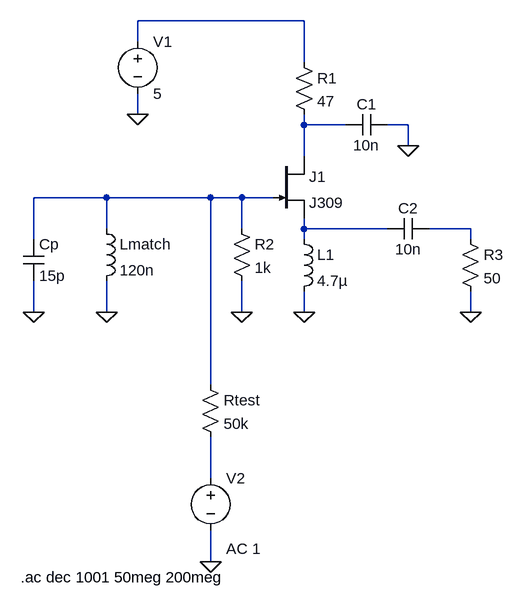
[diagram p0: schematic jfet_buffer.asc]
jfet_buffer.asc, the LTspice schematic file:
Version 4
SHEET 1 880 760
WIRE 112 -112 -144 -112
WIRE -144 -80 -144 -112
WIRE 112 -48 112 -112
WIRE -144 32 -144 0
WIRE 112 48 112 32
WIRE 176 48 112 48
WIRE 272 48 240 48
WIRE 272 80 272 48
WIRE 112 96 112 48
WIRE -192 160 -304 160
WIRE -32 160 -192 160
WIRE 16 160 -32 160
WIRE 64 160 16 160
WIRE -192 208 -192 160
WIRE 16 208 16 160
WIRE 112 208 112 192
WIRE 240 208 112 208
WIRE 368 208 304 208
WIRE -304 224 -304 160
WIRE 112 224 112 208
WIRE 368 224 368 208
WIRE -304 336 -304 288
WIRE -192 336 -192 288
WIRE 16 336 16 288
WIRE 112 336 112 304
WIRE 368 336 368 304
WIRE -32 448 -32 160
WIRE -32 592 -32 528
WIRE -32 720 -32 672
FLAG -144 32 0
FLAG 112 336 0
FLAG 272 80 0
FLAG 16 336 0
FLAG 368 336 0
FLAG -304 336 0
FLAG -192 336 0
FLAG -32 720 0
SYMBOL njf 64 96 R0
SYMATTR InstName J1
SYMATTR Value J309
SYMBOL voltage -144 -96 R0
SYMATTR InstName V1
SYMATTR Value 5
SYMBOL ind 96 208 R0
SYMATTR InstName L1
SYMATTR Value 4.7µ
SYMBOL res 96 -64 R0
SYMATTR InstName R1
SYMATTR Value 47
SYMBOL cap 240 32 R90
WINDOW 0 0 32 VBottom 2
WINDOW 3 32 32 VTop 2
SYMATTR InstName C1
SYMATTR Value 10n
SYMBOL res 0 192 R0
SYMATTR InstName R2
SYMATTR Value 1k
SYMBOL cap 304 192 R90
WINDOW 0 0 32 VBottom 2
WINDOW 3 32 32 VTop 2
SYMATTR InstName C2
SYMATTR Value 10n
SYMBOL res 352 208 R0
SYMATTR InstName R3
SYMATTR Value 50
SYMBOL cap -320 224 R0
SYMATTR InstName Cp
SYMATTR Value 15p
SYMBOL ind -208 192 R0
SYMATTR InstName Lmatch
SYMATTR Value 120n
SYMBOL res -48 432 R0
SYMATTR InstName Rtest
SYMATTR Value 50k
SYMBOL voltage -32 576 R0
WINDOW 123 24 124 Left 2
WINDOW 39 0 0 Left 0
SYMATTR InstName V2
SYMATTR Value ""
SYMATTR Value2 AC 1
TEXT -324 744 Left 2 !.ac dec 1001 50meg 200meg

The netlist it stands for:
* jfet_buffer.asc
J1 N002 N003 N004 J309
V1 N001 0 5
L1 N004 0 4.7µ
R1 N001 N002 47
C1 0 N002 10n
R2 N003 0 1k
C2 N005 N004 10n
R3 N005 0 50
Cp N003 0 15p
Lmatch N003 0 120n
Rtest N003 N006 50k
V2 N006 0 AC 1
.model NJF NJF
.model PJF PJF
.lib standard.jft
.ac dec 1001 50meg 200meg
.backanno
.end